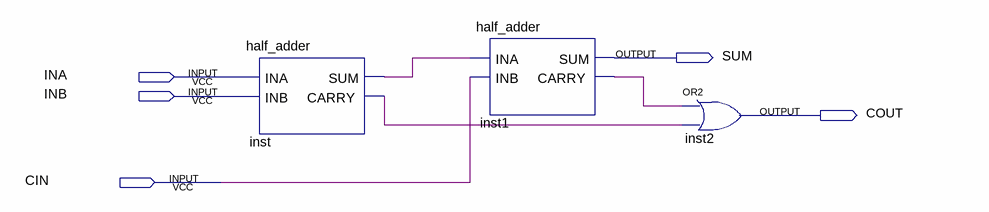
[diagram p0: schematic sheet]
// Quartus schematic full_adder.bdf as structural Verilog: 3 symbols, 5 pins
module full_adder (
  input  INA,
  input  INB,
  input  CIN,
  output SUM,
  output COUT
);

  wire inst1_carry, inst_carry, inst_sum;

  half_adder inst (.INA(INA), .INB(INB), .SUM(inst_sum), .CARRY(inst_carry));
  half_adder inst1 (.INA(inst_sum), .INB(CIN), .SUM(SUM), .CARRY(inst1_carry));
  or inst2 (COUT, inst1_carry, inst_carry);
endmodule
